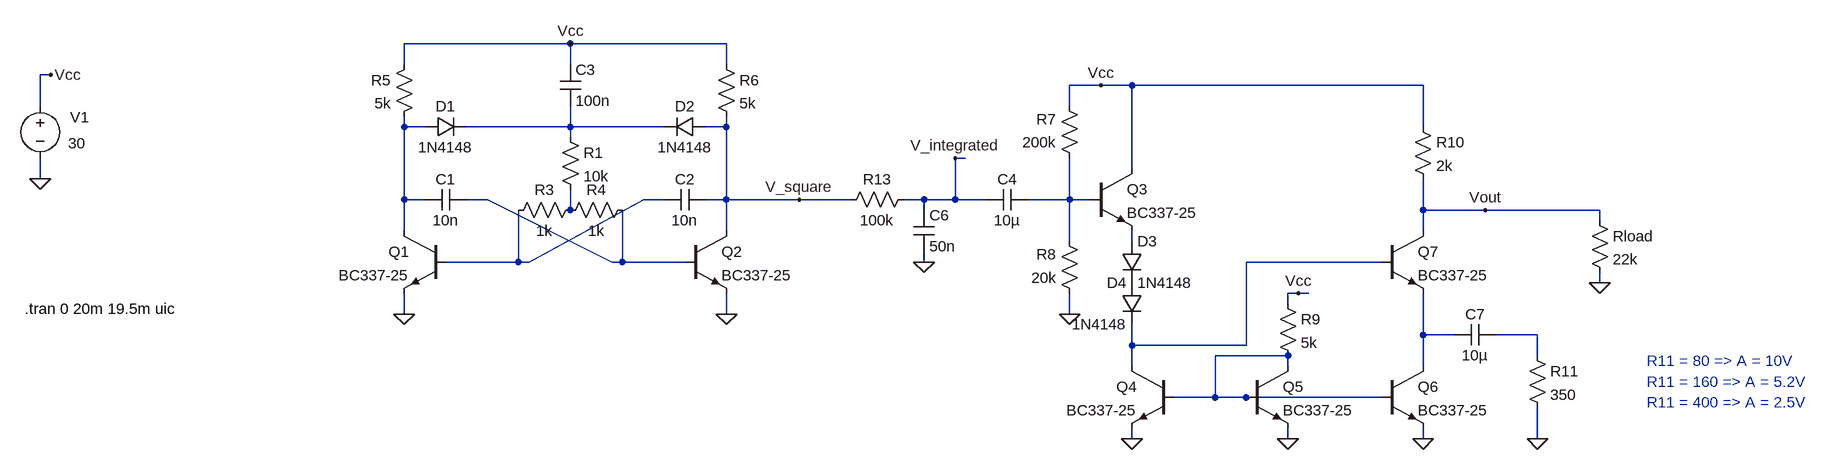
[diagram p0: schematic Proiect1_v2_Integrator.asc]
Proiect1_v2_Integrator.asc, the LTspice schematic file:
Version 4
SHEET 1 2252 680
WIRE 304 -112 48 -112
WIRE 544 -112 304 -112
WIRE 48 -80 48 -112
WIRE 304 -80 304 -112
WIRE 544 -80 544 -112
WIRE -496 -64 -512 -64
WIRE 1120 -48 1072 -48
WIRE 1168 -48 1120 -48
WIRE 1616 -48 1168 -48
WIRE -512 -16 -512 -64
WIRE 1072 -16 1072 -48
WIRE 48 16 48 0
WIRE 80 16 48 16
WIRE 304 16 304 -16
WIRE 304 16 144 16
WIRE 448 16 304 16
WIRE 544 16 544 0
WIRE 544 16 512 16
WIRE 1616 16 1616 -48
WIRE 304 32 304 16
WIRE 912 64 896 64
WIRE 1168 80 1168 -48
WIRE -512 96 -512 64
WIRE 48 128 48 16
WIRE 80 128 48 128
WIRE 176 128 144 128
WIRE 448 128 416 128
WIRE 544 128 544 16
WIRE 544 128 512 128
WIRE 656 128 544 128
WIRE 736 128 656 128
WIRE 848 128 816 128
WIRE 896 128 896 64
WIRE 896 128 848 128
WIRE 944 128 896 128
WIRE 1072 128 1072 64
WIRE 1072 128 1008 128
WIRE 1104 128 1072 128
WIRE 304 144 304 112
WIRE 848 144 848 128
WIRE 1616 144 1616 96
WIRE 1712 144 1616 144
WIRE 1888 144 1712 144
WIRE 1888 160 1888 144
WIRE 48 176 48 128
WIRE 544 176 544 128
WIRE 1616 176 1616 144
WIRE 1072 192 1072 128
WIRE 1168 192 1168 176
WIRE 224 224 224 144
WIRE 224 224 112 224
WIRE 240 224 416 128
WIRE 240 224 224 224
WIRE 368 224 176 128
WIRE 384 224 384 144
WIRE 384 224 368 224
WIRE 480 224 384 224
WIRE 848 224 848 208
WIRE 1552 224 1344 224
WIRE 1888 256 1888 240
WIRE 1424 272 1408 272
WIRE 1440 272 1424 272
WIRE 1408 288 1408 272
WIRE 48 304 48 272
WIRE 544 304 544 272
WIRE 1072 304 1072 272
WIRE 1616 336 1616 272
WIRE 1664 336 1616 336
WIRE 1792 336 1728 336
WIRE 1168 352 1168 320
WIRE 1344 352 1344 224
WIRE 1344 352 1168 352
WIRE 1408 368 1296 368
WIRE 1792 368 1792 336
WIRE 1168 384 1168 352
WIRE 1408 384 1408 368
WIRE 1616 384 1616 336
WIRE 1296 432 1296 368
WIRE 1296 432 1232 432
WIRE 1344 432 1296 432
WIRE 1552 432 1344 432
WIRE 1168 496 1168 480
WIRE 1408 496 1408 480
WIRE 1616 496 1616 480
WIRE 1792 496 1792 448
FLAG -496 -64 Vcc
FLAG -512 96 0
FLAG 48 304 0
FLAG 544 304 0
FLAG 304 -112 Vcc
FLAG 656 128 V_square
FLAG 1120 -48 Vcc
FLAG 848 224 0
FLAG 1168 496 0
FLAG 1408 496 0
FLAG 1424 272 Vcc
FLAG 1616 496 0
FLAG 896 64 V_integrated
FLAG 1072 304 0
FLAG 1792 496 0
FLAG 1712 144 Vout
FLAG 1888 256 0
SYMBOL voltage -512 -32 R0
WINDOW 0 46 33 Left 2
WINDOW 3 43 73 Left 2
WINDOW 123 0 0 Left 0
WINDOW 39 0 0 Left 0
SYMATTR InstName V1
SYMATTR Value 30
SYMBOL npn 112 176 M0
SYMATTR InstName Q1
SYMATTR Value BC337-25
SYMBOL npn 480 176 R0
SYMATTR InstName Q2
SYMATTR Value BC337-25
SYMBOL res 320 128 R90
WINDOW 0 0 56 VBottom 2
WINDOW 3 32 56 VTop 2
SYMATTR InstName R3
SYMATTR Value 1k
SYMBOL res 400 128 R90
WINDOW 0 0 56 VBottom 2
WINDOW 3 32 56 VTop 2
SYMATTR InstName R4
SYMATTR Value 1k
SYMBOL cap 144 112 R90
WINDOW 0 0 32 VBottom 2
WINDOW 3 32 32 VTop 2
SYMATTR InstName C1
SYMATTR Value 10n
SYMBOL cap 512 112 R90
WINDOW 0 0 32 VBottom 2
WINDOW 3 32 32 VTop 2
SYMATTR InstName C2
SYMATTR Value 10n
SYMBOL cap 288 -80 R0
SYMATTR InstName C3
SYMATTR Value 100n
SYMBOL diode 80 32 R270
WINDOW 0 32 32 VTop 2
WINDOW 3 0 32 VBottom 2
SYMATTR InstName D1
SYMATTR Value 1N4148
SYMBOL diode 512 0 R90
WINDOW 0 0 32 VBottom 2
WINDOW 3 32 32 VTop 2
SYMATTR InstName D2
SYMATTR Value 1N4148
SYMBOL res 64 -96 M0
SYMATTR InstName R5
SYMATTR Value 5k
SYMBOL res 528 -96 R0
SYMATTR InstName R6
SYMATTR Value 5k
SYMBOL cap 1008 112 R90
WINDOW 0 0 32 VBottom 2
WINDOW 3 32 32 VTop 2
SYMATTR InstName C4
SYMATTR Value 10µ
SYMBOL npn 1104 80 R0
SYMATTR InstName Q3
SYMATTR Value BC337-25
SYMBOL res 1088 80 R180
WINDOW 0 36 76 Left 2
WINDOW 3 36 40 Left 2
SYMATTR InstName R7
SYMATTR Value 200k
SYMBOL res 832 112 R90
WINDOW 0 0 56 VBottom 2
WINDOW 3 32 56 VTop 2
SYMATTR InstName R13
SYMATTR Value 100k
SYMBOL cap 832 144 R0
SYMATTR InstName C6
SYMATTR Value 50n
SYMBOL npn 1232 384 M0
SYMATTR InstName Q4
SYMATTR Value BC337-25
SYMBOL npn 1344 384 R0
SYMATTR InstName Q5
SYMATTR Value BC337-25
SYMBOL res 1392 272 R0
SYMATTR InstName R9
SYMATTR Value 5k
SYMBOL npn 1552 384 R0
SYMATTR InstName Q6
SYMATTR Value BC337-25
SYMBOL npn 1552 176 R0
SYMATTR InstName Q7
SYMATTR Value BC337-25
SYMBOL res 1600 0 R0
SYMATTR InstName R10
SYMATTR Value 2k
SYMBOL res 1088 288 R180
WINDOW 0 36 76 Left 2
WINDOW 3 36 40 Left 2
SYMATTR InstName R8
SYMATTR Value 20k
SYMBOL res 1776 352 R0
SYMATTR InstName R11
SYMATTR Value 350
SYMBOL cap 1728 320 R90
WINDOW 0 0 32 VBottom 2
WINDOW 3 32 32 VTop 2
SYMATTR InstName C7
SYMATTR Value 10µ
SYMBOL res 1872 144 R0
SYMATTR InstName Rload
SYMATTR Value 22k
SYMBOL diode 1152 192 R0
SYMATTR InstName D3
SYMATTR Value 1N4148
SYMBOL diode 1184 256 M0
SYMATTR InstName D4
SYMATTR Value 1N4148
SYMBOL res 288 16 R0
SYMATTR InstName R1
SYMATTR Value 10k
TEXT -536 296 Left 2 !.tran 0 20m 19.5m uic
TEXT 1960 376 Left 2 ;R11 = 80 => A = 10V
TEXT 1960 408 Left 2 ;R11 = 160 => A = 5.2V
TEXT 1960 440 Left 2 ;R11 = 400 => A = 2.5V

The netlist it stands for:
* Proiect1_v2_Integrator.asc
V1 Vcc 0 30
Q1 N001 N004 0 0 BC337-25
Q2 V_square N003 0 0 BC337-25
R3 N006 N004 1k
R4 N003 N006 1k
C1 N003 N001 10n
C2 V_square N004 10n
C3 Vcc N002 100n
D1 N001 N002 1N4148
D2 V_square N002 1N4148
R5 Vcc N001 5k
R6 Vcc V_square 5k
C4 N005 V_integrated 10µ
Q3 Vcc N005 N007 0 BC337-25
R7 N005 Vcc 200k
R13 V_integrated V_square 100k
C6 V_integrated 0 50n
Q4 N008 N011 0 0 BC337-25
Q5 N011 N011 0 0 BC337-25
R9 Vcc N011 5k
Q6 N009 N011 0 0 BC337-25
Q7 Vout N008 N009 0 BC337-25
R10 Vcc Vout 2k
R8 0 N005 20k
R11 N010 0 350
C7 N010 N009 10µ
Rload Vout 0 22k
D3 N007 P001 1N4148
D4 P001 N008 1N4148
R1 N002 N006 10k
.model D D
.lib standard.dio
.model NPN NPN
.model PNP PNP
.lib standard.bjt
.tran 0 20m 19.5m uic
* R11 = 80 => A = 10V
* R11 = 160 => A = 5.2V
* R11 = 400 => A = 2.5V
.backanno
.end

* Results of the author's LTspice run, read from the files saved beside the schematic
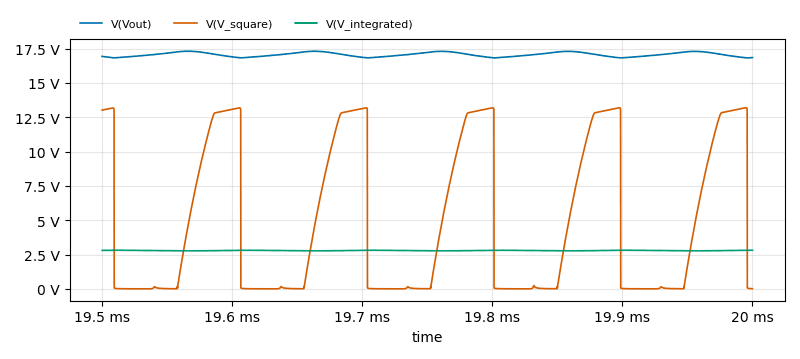
[diagram p1: Transient Analysis of Proiect1_v2_Integrator.asc, plotted from the saved traces]
* Transient Analysis, 1 run:
*   V(Vout): min 16.82 V, max 17.31 V, average 17.06 V, rms 17.06 V, last 16.85 V
*   V(V_square): min 9.767 mV, max 13.19 V, average 4.927 V, rms 7.482 V, last 20.73 mV
*   V(V_integrated): min 2.774 V, max 2.826 V, average 2.797 V, rms 2.797 V, last 2.822 V